# EAGLE schematic WattMeter_v4_I2C (EAGLE 9.0.0)
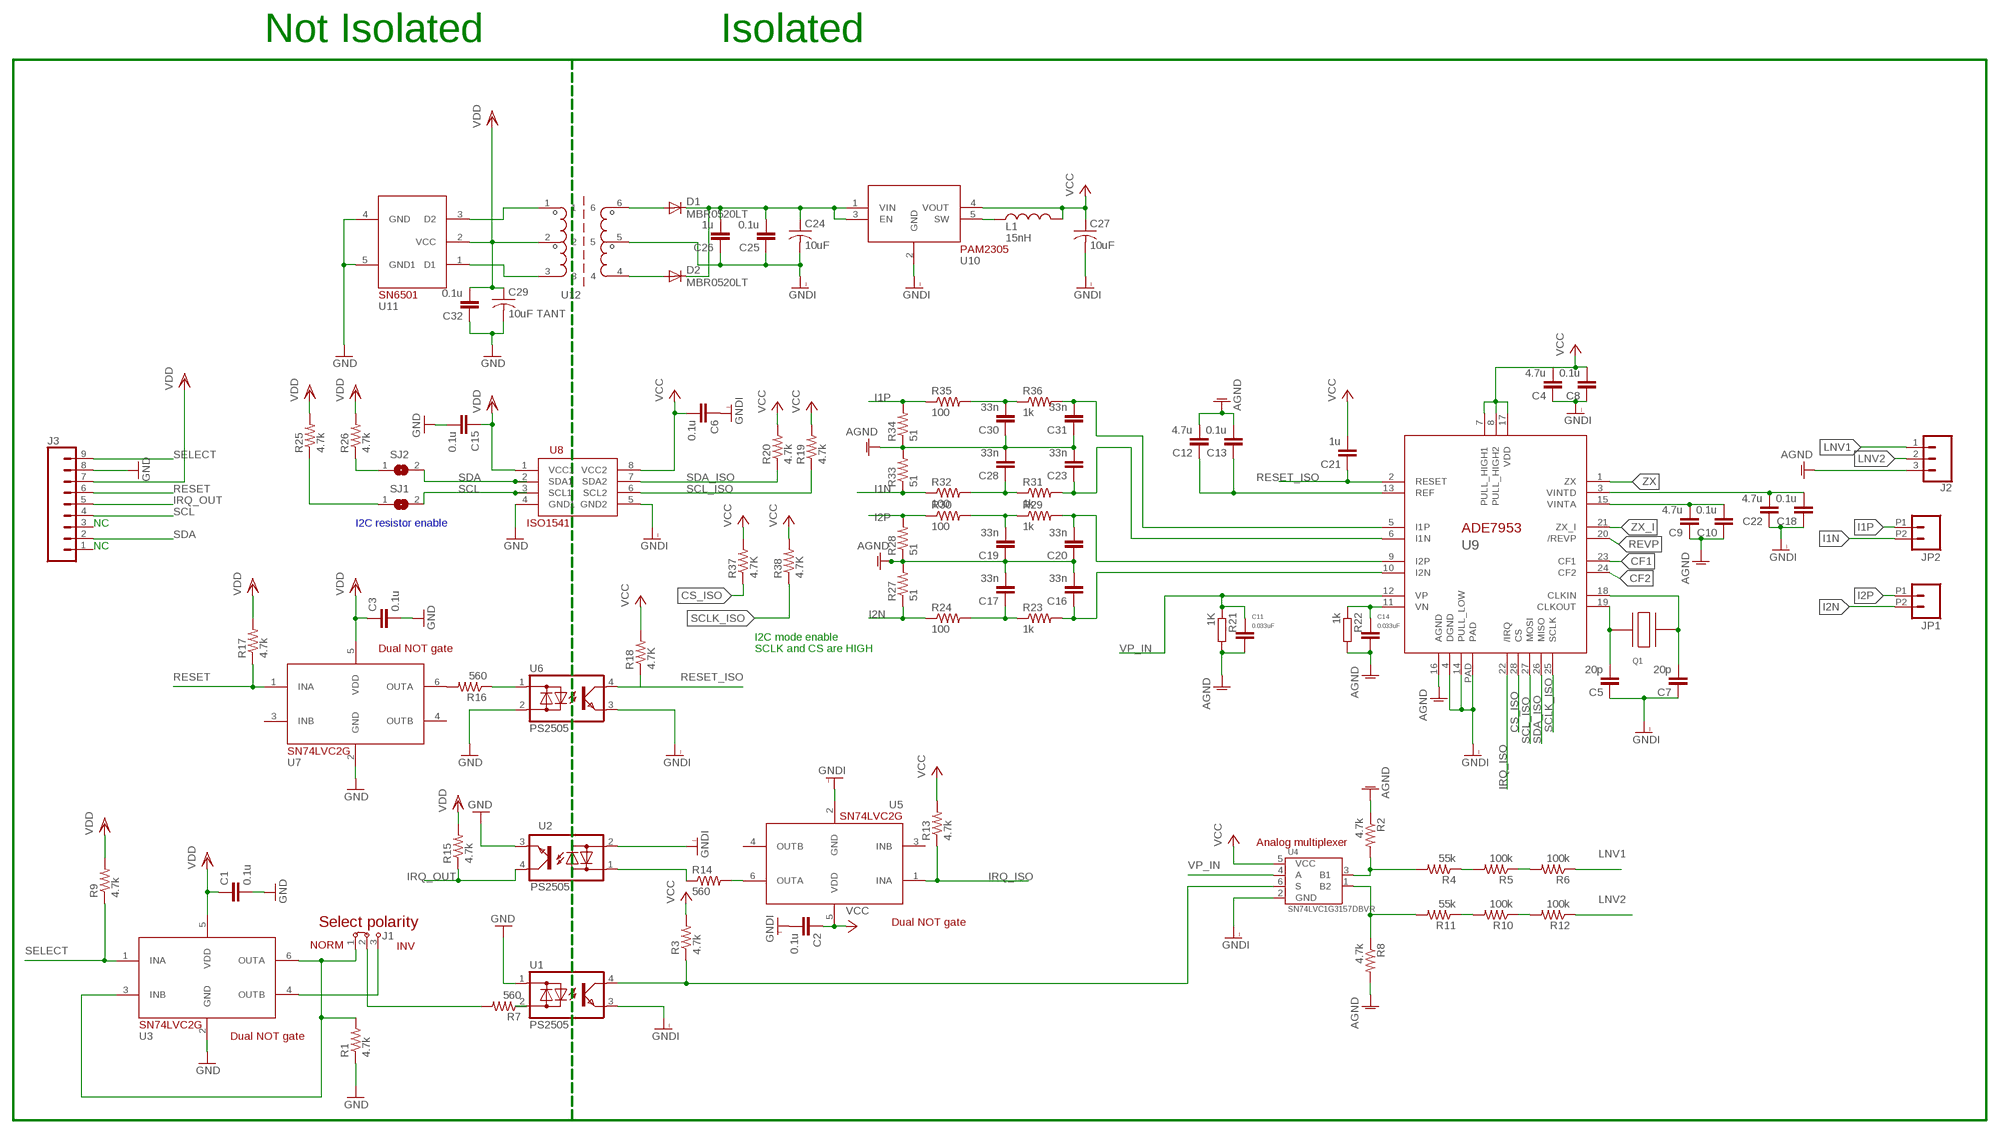
[diagram p0: schematic, sheet 1]

## Parts
C1  0.1u  0402-CAP  [0402-CAP]
C2  0.1u  0402-CAP  [0402-CAP]
C3  0.1u  0402-CAP  [0402-CAP]
C4  4.7u  0402-CAP  [0402-CAP]
C5  20p  0402-CAP  [0402-CAP]
C6  0.1u  0402-CAP  [0402-CAP]
C7  20p  0402-CAP  [0402-CAP]
C8  0.1u  0402-CAP  [0402-CAP]
C9  4.7u  0402-CAP  [0402-CAP]
C10  0.1u  0402-CAP  [0402-CAP]
C11  0.033uF  C-EUC0805K  [C0805K]
C12  4.7u  0402-CAP  [0402-CAP]
C13  0.1u  0402-CAP  [0402-CAP]
C14  0.033uF  C-EUC0805K  [C0805K]
C15  0.1u  0402-CAP  [0402-CAP]
C16  33n  0402-CAP  [0402-CAP]
C17  33n  0402-CAP  [0402-CAP]
C18  0.1u  0402-CAP  [0402-CAP]
C19  33n  0402-CAP  [0402-CAP]
C20  33n  0402-CAP  [0402-CAP]
C21  1u  0402-CAP  [0402-CAP]
C22  4.7u  0402-CAP  [0402-CAP]
C23  33n  0402-CAP  [0402-CAP]
C24  10uF  C-USC0603  [C0603]
C25  0.1u  0402-CAP  [0402-CAP]
C26  1u  0402-CAP  [0402-CAP]
C27  10uF  C-USC0603  [C0603]
C28  33n  0402-CAP  [0402-CAP]
C29  10uF TANT  C-USC0603  [C0603]
C30  33n  0402-CAP  [0402-CAP]
C31  33n  0402-CAP  [0402-CAP]
C32  0.1u  0402-CAP  [0402-CAP]
D1  MBR0520LT  [SOD123]
D2  MBR0520LT  [SOD123]
J1  JUMPER3  [1X03]
J2  CONN_03-SCREW-5MM  [SCREWTERMINAL-5MM-3]
J3  CONN_09  [1X09]
JP1  M022.54MM_SCREWTERM  [1X02_2.54_SCREWTERM]
JP2  M022.54MM_SCREWTERM  [1X02_2.54_SCREWTERM]
L1  15nH  IND0402  [0402-RES]
Q1  QUARTZ_3.58M_2PIN  [HC-49S]
R1  4.7k  0402-RES  [0402-RES]
R2  4.7k  RESISTOR0603-RES  [0603-RES]
R3  4.7k  0402-RES  [0402-RES]
R4  55k  RESISTOR0603-RES  [0603-RES]
R5  100k  RESISTOR0603-RES  [0603-RES]
R6  100k  RESISTOR0603-RES  [0603-RES]
R7  560  0402-RES  [0402-RES]
R8  4.7k  RESISTOR0603-RES  [0603-RES]
R9  4.7k  0402-RES  [0402-RES]
R10  100k  RESISTOR0603-RES  [0603-RES]
R11  55k  RESISTOR0603-RES  [0603-RES]
R12  100k  RESISTOR0603-RES  [0603-RES]
R13  4.7k  0402-RES  [0402-RES]
R14  560  0402-RES  [0402-RES]
R15  4.7k  0402-RES  [0402-RES]
R16  560  0402-RES  [0402-RES]
R17  4.7k  0402-RES  [0402-RES]
R18  4.7K  0402-RES  [0402-RES]
R19  4.7k  0402-RES  [0402-RES]
R20  4.7k  0402-RES  [0402-RES]
R21  1K  R-EU_  [C0805K@1]
R22  1k  R-EU_  [C0805K@1]
R23  1k  0402-RES  [0402-RES]
R24  100  0402-RES  [0402-RES]
R25  4.7k  0402-RES  [0402-RES]
R26  4.7k  0402-RES  [0402-RES]
R27  51  0402-RES  [0402-RES]
R28  51  0402-RES  [0402-RES]
R29  1k  0402-RES  [0402-RES]
R30  100  0402-RES  [0402-RES]
R31  1k  0402-RES  [0402-RES]
R32  100  0402-RES  [0402-RES]
R33  51  0402-RES  [0402-RES]
R34  51  0402-RES  [0402-RES]
R35  100  0402-RES  [0402-RES]
R36  1k  0402-RES  [0402-RES]
R37  4.7K  0402-RES  [0402-RES]
R38  4.7K  0402-RES  [0402-RES]
SJ1  SJ  [SJ]
SJ2  SJ  [SJ]
U1  PS2505  [PS2505]
U2  PS2505  [PS2505]
U3  SN74LVC  [DCKT]
U4  SN74LVC1G3157DBVR  [SOT-23-6]
U5  SN74LVC  [DCKT]
U6  PS2505  [PS2505]
U7  SN74LVC  [DCKT]
U8  ISO1541  [ISO1541]
U9  ADE7953  [28-WFQFN]
U10  PAM2305  [TSOT25]
U11  SN6501  [SOT-23-5]
U12  TRANSFO_3.3  [TRANSFO_3.3]

## Nets
AGND: C9.1 C10.1 C11.2 C12.2 C13.2 C14.2 C16.2 C17.2 C19.1 C20.1 C23.2 C28.2 C30.1 C31.1 J2.3 R2.1 R8.2 R21.2 R22.2 R27.2 R28.1 R33.2 R34.1 U9.16(AGND)
CF1: U9.23(CF1)
CF2: U9.24(CF2)
CS_ISO: R37.1 U9.28(CS)
GND: C1.2 C3.2 C15.2 C29.2 C32.1 J3.8 R1.1 U1.1(ANODE) U2.3(EMITTER) U3.2(GND) U6.2(CATHODE) U7.2(GND) U8.4(GND1) U11.4(GND) U11.5(GND1)
GNDI: C2.2 C4.1 C5.1 C6.1 C7.1 C8.1 C18.1 C22.1 C24.2 C25.1 C26.1 C27.2 U1.3(EMITTER) U2.2(CATHODE) U4.2(GND) U5.2(GND) U6.3(EMITTER) U8.5(GND2) U9.4(DGND) U9.14(PULL_LOW) U9.PAD U10.2(GND) U12.5
I1N: JP2.P2 R32.1 R33.1
I1P: JP2.P1 R34.2 R35.1
I2N: JP1.P2 R24.1 R27.1
I2P: JP1.P1 R28.2 R30.1
IRQ_ISO: R13.1 U5.1(INA) U9.22(/IRQ)
IRQ_OUT: J3.5 R15.1 U2.4(COLLERTOR)
LNV1: J2.1 R6.1
LNV2: J2.2 R12.1
N$1: C5.2 Q1.1 U9.19(CLKOUT)
N$2: C7.2 Q1.2 U9.18(CLKIN)
N$3 [ic]: C14.1 R22.1 U9.11(VN)
N$4: L1.1 U10.5(SW)
N$7: C12.1 C13.1 U9.13(REF)
N$8: C9.2 C10.2 U9.15(VINTA)
N$10: C23.1 R31.2 U9.6(I1N)
N$11: C31.2 R36.2 U9.5(I1P)
N$12: C18.2 C22.2 U9.3(VINTD)
N$13: R10.1 R12.2
N$17: J1.3 U3.4(OUTB)
N$18: D1.A U12.6
N$19: C24.1 C25.2 C26.2 D1.C D2.C U10.1(VIN) U10.3(EN)
N$20: D2.A U12.4
N$21: U11.3(D2) U12.1
N$22: R10.2 R11.1
N$23: U11.1(D1) U12.3
N$24: C30.2 R35.2 R36.1
N$25: R16.1 U6.1(ANODE)
N$26: R16.2 U7.6(OUTA)
N$27: C28.1 R31.1 R32.2
N$28: C16.1 R23.2 U9.10(I2N)
N$29: R26.1 SJ2.1
N$30: R14.2 U5.6(OUTA)
N$32: C20.2 R29.2 U9.9(I2P)
N$33: C19.2 R29.1 R30.2
N$34: C17.1 R23.1 R24.2
N$35: R5.1 R6.2
N$36: R4.1 R5.2
N$37: R8.1 R11.2 U4.1(B2)
N$38: R2.2 R4.2 U4.3(B1)
N$39: R14.1 U2.1(ANODE)
N$40: J1.1 R1.2 U3.3(INB) U3.6(OUTA)
N$42: J1.2 R7.2
N$43: R7.1 U1.2(CATHODE)
N$44: R25.1 SJ1.1
RESET: J3.6 R17.1 U7.1(INA)
RESET_ISO: C21.1 R18.1 U6.4(COLLERTOR) U9.2(RESET)
REVP: U9.20(/REVP)
SCL: J3.4 SJ1.2 U8.3(SCL1)
SCL_ISO: R19.1 U8.6(SCL2) U9.27(MOSI)
SCLK_ISO: R38.1 U9.25(SCLK)
SDA: J3.2 SJ2.2 U8.2(SDA1)
SDA_ISO: R20.1 U8.7(SDA2) U9.26(MISO)
SELECT: J3.9 R9.1 U3.1(INA)
SETPHASE: R3.1 U1.4(COLLERTOR) U4.6(S)
V2P [ic]: C11.1 R21.1 U9.12(VP)
VCC: C2.1 C4.2 C6.2 C8.2 C21.2 C27.1 L1.2 R3.2 R13.2 R18.2 R19.2 R20.2 R37.2 R38.2 U4.5(VCC) U5.5(VDD) U8.8(VCC2) U9.7(PULL_HIGH1) U9.8(PULL_HIGH2) U9.17(VDD) U10.4(VOUT)
VDD: C1.1 C3.1 C15.1 C29.1 C32.2 J3.7 R9.2 R15.2 R17.2 R25.2 R26.2 U3.5(VDD) U7.5(VDD) U8.1(VCC1) U11.2(VCC) U12.2
VP_IN: U4.4(A)
ZX: U9.1(ZX)
ZX_I: U9.21(ZX_I)
Unconnected: J3.1 J3.3 U5.3(INB) U5.4(OUTB) U7.3(INB) U7.4(OUTB)

## Notes on the sheet
- Not Isolated | Isolated
- NC | I2C resistor enable
- NC
- I2C mode enable
- Dual NOT gate | SCLK and CS are HIGH
- Analog multiplexer
- Select polarity | Dual NOT gate
- NORM | INV
- Dual NOT gate

## Library data of the parts
C1-C10 C12 C13 C15-C23 C25 C26 C28 C30-C32 = Nizanlib:0402-CAP
C11 C14 = resistor:C-EU: CAPACITOR, European symbol
C24 C27 C29 = resistor:C-US: CAPACITOR, American symbol
D1 D2 = diode:MBR0520LT: SCHOTTKY BARRIER RECTIFIER Source: http://onsemi.com .. MBR0520LT1-D.pdf
J1 = Jumper:JUMPER3
J2 = SparkFun-Connectors:CONN_03: Multi connection point. Often used as Generic Header-pin footprint for 0.1 inch spaced/style header connections On any of the 0.1 inch spaced packages, you can populate with these: Break Away Headers - Straight <https://www.sparkfun.com/products/116> (PRT-00116) Break Away Male Headers - Right Angle <https://www.sparkfun.com/products/553> (PRT-00553) Female Headers <https://www.sparkfun.com/products/115> (PRT-00115) Break Away Headers - Machine Pin <https://www.sparkfun.com/products/117> (PRT-00117) Break Away Female Headers - Swiss Machine Pin <https://www.sparkfun.com/products/743> (PRT-00743) Stackable Header - 3 Pin (Female, 0.1") <https://www.sparkfun.com/products/13875> (PRT-13875) For SCREWTERMINALS and SPRING TERMINALS visit here: Screw Terimnals on SparkFun.com <https://www.sparkfun.com/search/results?term=Screw+Terminals> (5mm/3.5mm/2.54mm spacing) This device is also useful as a general connection point to wire up your design to another part of your project. Our various solder wires solder well into these plated through hole pads. Hook-Up Wire - Assortment (Stranded, 22 AWG) <https://www.sparkfun.com/products/11375> (PRT-11375) Hook-Up Wire - Assortment (Solid Core, 22 AWG) <https://www.sparkfun.com/products/11367> (PRT-11367) View the entire wire category on our website here <https://www.sparkfun.com/categories/141> Special notes: Molex polarized connector foot print use with SKU : PRT-08232 with associated crimp pins and housings.; PROD_ID: CONN-10134; SF_SKU: PRT-08433
J3 = SparkFun-Connectors:CONN_09: Multi connection point. Often used as Generic Header-pin footprint for 0.1 inch spaced/style header connections On any of the 0.1 inch spaced packages, you can populate with these: Break Away Headers - Straight <https://www.sparkfun.com/products/116> (PRT-00116) Break Away Male Headers - Right Angle <https://www.sparkfun.com/products/553> (PRT-00553) Female Headers <https://www.sparkfun.com/products/115> (PRT-00115) Break Away Headers - Machine Pin <https://www.sparkfun.com/products/117> (PRT-00117) Break Away Female Headers - Swiss Machine Pin <https://www.sparkfun.com/products/743> (PRT-00743) For SCREWTERMINALS and SPRING TERMINALS visit here: Screw Terimnals on SparkFun.com <https://www.sparkfun.com/search/results?term=Screw+Terminals> (5mm/3.5mm/2.54mm spacing) This device is also useful as a general connection point to wire up your design to another part of your project. Our various solder wires solder well into these plated through hole pads. Hook-Up Wire - Assortment (Stranded, 22 AWG) <https://www.sparkfun.com/products/11375> (PRT-11375) Hook-Up Wire - Assortment (Solid Core, 22 AWG) <https://www.sparkfun.com/products/11367> (PRT-11367) View the entire wire category on our website here <https://www.sparkfun.com/categories/141> Special notes: Molex polarized connector foot print use with SKU : PRT-08231 with associated crimp pins and housings. 1MM SMD Version SKU: PRT-10208 NOTES ON THE VARIANTS LOCK and LOCK_LONGPADS... This footprint was designed to help hold the alignment of a through-hole component (i.e. 6-pin header) while soldering it into place. You may notice that each hole has been shifted either up or down by 0.005 of an inch from it's more standard position (which is a perfectly straight line). This slight alteration caused the pins (the squares in the middle) to touch the edges of the holes. Because they are alternating, it causes a "brace" to hold the component in place. 0.005 has proven to be the perfect amount of "off-center" position when using our standard breakaway headers. Although looks a little odd when you look at the bare footprint, once you have a header in there, the alteration is very hard to notice. Also,if you push a header all the way into place, it is covered up entirely on the bottom side.
JP1 JP2 = SparkFun-Connectors:M02: Standard 2-pin 0.1" header. Use with - straight break away headers ( PRT-00116) - right angle break away headers (PRT-00553) - swiss pins (PRT-00743) - machine pins (PRT-00117) - female headers (PRT-00115) Molex polarized connector foot print use with: PRT-08233 with associated crimp pins and housings. 2.54_SCREWTERM for use with PRT-10571. 3.5mm Screw Terminal footprints for PRT-08084 5mm Screw Terminal footprints for use with PRT-08432
L1 = Nizanlib:IND0402
Q1 = CalPlug:QUARTZ_3.58M_2PIN; DIGIKEY: http://www.digikey.com/product-detail/en/txc-corporation/9C-3.579545MBBK-T/887-2450-1-ND/4475440
R1 R3 R7 R9 R13-R20 R23-R38 = Nizanlib:0402-RES
R2 R4-R6 R8 R10-R12 = SparkFun:RESISTOR: Resistor Basic schematic elements and footprints for 0603, 1206, and PTH 1/10th watt (small) resistors.
R21 R22 = resistor:R-EU_: RESISTOR, European symbol
SJ1 SJ2 = jumper:SJ: SMD solder JUMPER
U1 U2 U6 = wattmeter:PS2505
U3 U5 = Damien_divers:SN74LVC
U4 = TI:SN74LVC1G3157
U7 = Damien_divers:SN74LVC; SPICEPREFIX: X
U8 = wattmeter:ISO1541
U9 = CalPlug:ADE7953
U10 = Damien_regulator:PAM2305
U11 = CalPlug:SN6501
U12 = Damien_power:TRANSFO_3.3

## Net classes
0 default: clearance 0.205 mm
1 HIGHVOLTAGE: width 0.254 mm, drill 0.508 mm, clearance 2.413 mm to class 0, clearance 0.152 mm
2 ic: width 0.152 mm, drill 0.305 mm, clearance 0.205 mm to class 0, clearance 2.413 mm to class 1, clearance 0.205 mm